# Altium schematic sheet GPIOSheet.SchDoc
size A; SheetNumber: 4; SheetTotal: 4
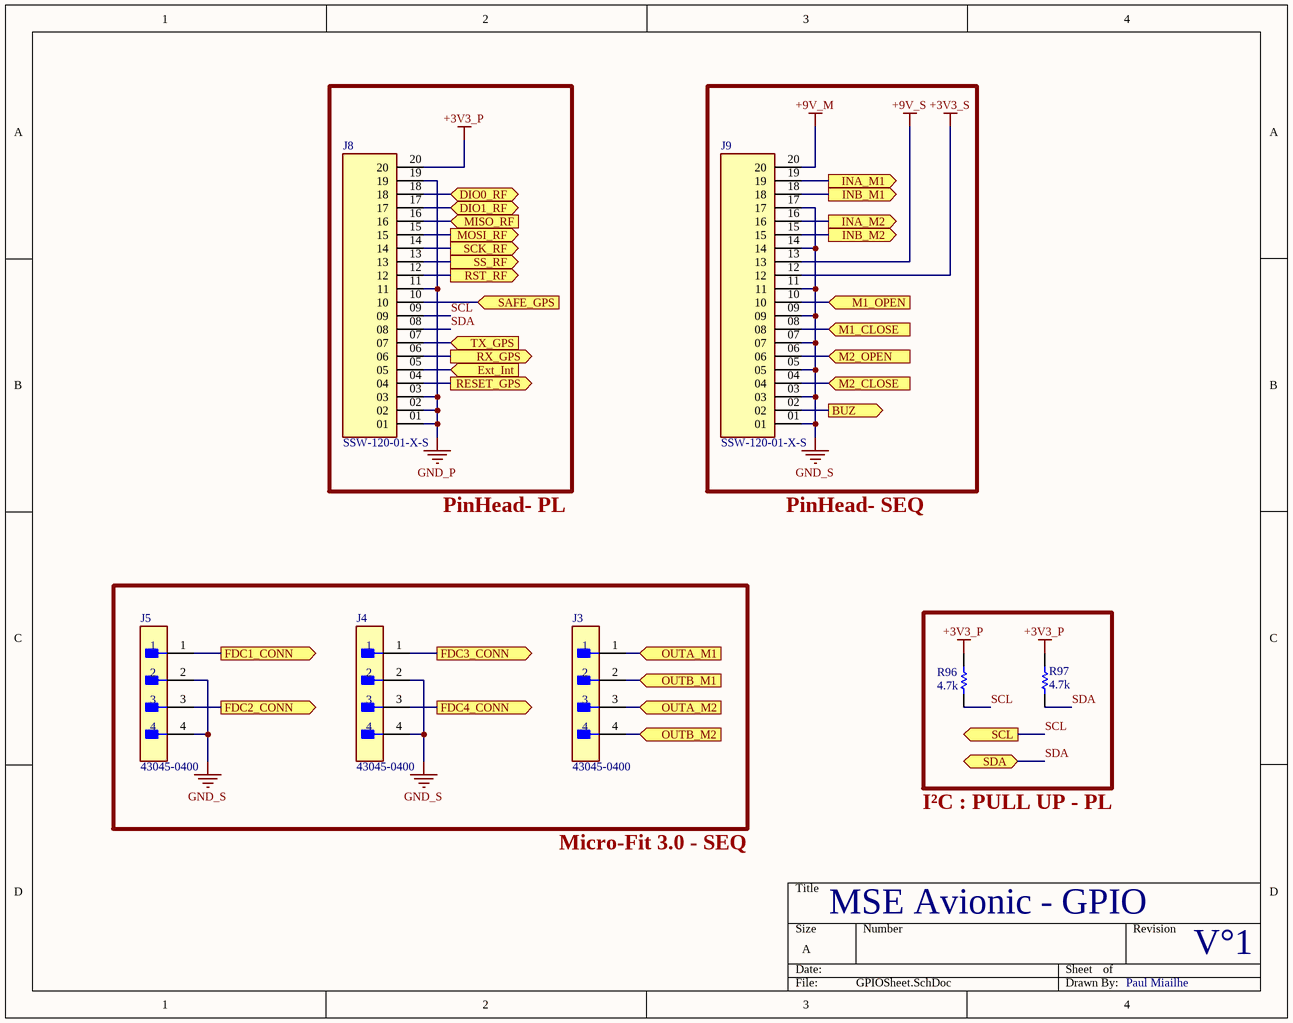
[diagram p0: GPIOSheet.SchDoc]

## Parts
J3  43045-0400  [FP-43045-0400-MFG]
J4  43045-0400  [FP-43045-0400-MFG]
J5  43045-0400  [FP-43045-0400-MFG]
J8  SSW-120-01-X-S  [SAMTEC_SSW-120-01-X-S]
J9  SSW-120-01-X-S  [SAMTEC_SSW-120-01-X-S]
R96  Resistance: 4.7k  [RESC1608X55X25LL10T15]  (hidden comment: RC0603FR-074K7L)
R97  Resistance: 4.7k  [RESC1608X55X25LL10T15]  (hidden comment: RC0603FR-074K7L)

## Ports
BUZ (out), DIO0_RF (bidir), DIO1_RF (bidir), Ext_Int (in), FDC1_CONN (out), FDC2_CONN (out), FDC3_CONN (out), FDC4_CONN (out), INA_M1 (out), INA_M2 (out), INB_M1 (out), INB_M2 (out), M1_CLOSE (in), M1_OPEN (in), M2_CLOSE (in), M2_OPEN (in), MISO_RF (in), MOSI_RF (out), OUTA_M1 (in), OUTA_M2 (in), OUTB_M1 (in), OUTB_M2 (in), RESET_GPS (out), RST_RF (out), RX_GPS (out), SAFE_GPS (in), SCK_RF (out), SCL (out), SDA (bidir), SS_RF (out), TX_GPS (in)

## Nets
+3V3_P: J8.20 R96.2 R97.2
+3V3_S: J9.12
+9V_M: J9.20
+9V_S: J9.13
GND_P: J8.01 J8.02 J8.03 J8.11 J8.19
GND_S: J4.2 J4.4 J5.2 J5.4 J9.01 J9.03 J9.05 J9.07 J9.09 J9.11 J9.14 J9.17
BUZ: J9.02 ; port BUZ
DIO0_RF: J8.18 ; port DIO0_RF
DIO1_RF: J8.17 ; port DIO1_RF
Ext_Int: J8.05 ; port Ext_Int
FDC1_CONN: J5.1 ; port FDC1_CONN
FDC2_CONN: J5.3 ; port FDC2_CONN
FDC3_CONN: J4.1 ; port FDC3_CONN
FDC4_CONN: J4.3 ; port FDC4_CONN
INA_M1: J9.19 ; port INA_M1
INA_M2: J9.16 ; port INA_M2
INB_M1: J9.18 ; port INB_M1
INB_M2: J9.15 ; port INB_M2
M1_CLOSE: J9.08 ; port M1_CLOSE
M1_OPEN: J9.10 ; port M1_OPEN
M2_CLOSE: J9.04 ; port M2_CLOSE
M2_OPEN: J9.06 ; port M2_OPEN
MISO_RF: J8.16 ; port MISO_RF
MOSI_RF: J8.15 ; port MOSI_RF
OUTA_M1: J3.1 ; port OUTA_M1
OUTA_M2: J3.3 ; port OUTA_M2
OUTB_M1: J3.2 ; port OUTB_M1
OUTB_M2: J3.4 ; port OUTB_M2
RESET_GPS: J8.04 ; port RESET_GPS
RST_RF: J8.12 ; port RST_RF
RX_GPS: J8.06 ; port RX_GPS
SAFE_GPS: J8.10 ; port SAFE_GPS
SCK_RF: J8.14 ; port SCK_RF
SCL: J8.09 R96.1 ; port SCL
SDA: J8.08 R97.1 ; port SDA
SS_RF: J8.13 ; port SS_RF
TX_GPS: J8.07 ; port TX_GPS

## Notes on the sheet
- PinHead- PL
- PinHead- SEQ
- Micro-Fit 3.0 - SEQ
- I²C : PULL UP - PL
- MSE Avionic - GPIO
- V°1
- Paul Miailhe

## Library data of the parts
J3-J5 = CMP-04776-000002-1: CONN HEADER R/A 4POS 3MM; Manufacturer: Molex; Conn Gender: Male; Conn Orientation: Right Angle; Voltage Rating: 600V; Number Of Contacts: 4; Is Female: yes; Current Rating: 8.5A; ComponentLink2URL: https://www.molex.com/webdocs/datasheets/pdf/en-us/0430450400_PCB_HEADERS.pdf; Manufacturer Part Number: 43045-0400; Digikey Description: CONN HEADER R/A 4POS 3MM; Category: Conn; Temperature Range High: +105°C; Lead Free: Yes; Device Class L1: Connectors; Automotive: No; Temperature: -40°C to +105°C; Footprint Url: https://www.molex.com/pdm_docs/sd/430450400_sd.pdf; Height: 9.27mm; Number Of Rows: 2; Device Class L3: unset; Pitch: 3mm; Temperature Range Low: -40°C; Contact Material: Tin,Nickel; Octopart: https://octopart.com/43045-0400-molex-287063; RoHS: TRUE; ComponentLink2Description: Datasheet; Package: 43045-0400; Device Class L2: Headers and Wire Housings
J8 J9 = CMP-011-000000-2: SSW - Samtec 2.54mm Single Row Straight Socket Strip 8.5 Profile - Fast Stock; MP: SSW-120-01-G-S; Value: *; Check_prices: https://www.snapeda.com/parts/SSW-120-01-G-S/Samtec/view-part/598388/?ref=eda; Price: None; Design Item ID: SSW-120-01-X-S; SnapEDA_Link: https://www.snapeda.com/parts/SSW-120-01-G-S/Samtec/view-part/598388/?ref=snap; Component Type: Standard; MF: Samtec; Source: SSW-120-01-X-S.SchLib; Package: None; Pin Count: 20; Availability: Bad; Purchase-URL: https://pricing.snapeda.com/search/part/SSW-120-01-G-S/?ref=eda
R96 R97 = CMP-2000-06942-1: Chip Resistor, 4.7 KOhm, +/- 1%, 0.1 W, -55 to 155 degC, 0603 (1608 Metric), RoHS, Tape and Reel; Manufacturer: Yageo; Power Rating: 100mW; Temperature Coefficient: 100PPM/C; Voltage Rating: 50V; Package Reference: 0603; Series: RC; Datasheet Version: Rev. 7, 05/2017; Packaging: Reel; Termination Style: SMD/SMT; Datasheet URL: http://www.yageo.com/documents/recent/PYu-RC_Group_51_RoHS_L_7.pdf; Manufacturer URL: http://www.yageo.com/; Package Description: 2-Pin Surface Mount Device, Body 1.6 x 0.8 mm; Case Code - mm: 1608; Mounting Technology: SurfaceMount; Operating Temperature Range: -55Cto+155C; Tolerance: 1%; Product: ThickFilmResistorsGeneralPurpose; Supplier 1: Mouser; Supplier Part Number 1: 603-RC0603FR-074K7L; Manufacturer Part Number: RC0603FR-074K7L; RoHS: Yes; Category: Chip SMD Resistors; Stock 1: 772810; Pricing 1: 1=0,10000, 10=0,02400, 50=0,02400, 100=0,01000, 1000=0,00400, 5000=0,00300, 10000=0,00300 (USD); Case/Package: 0603; Number of Pins: 2; Case Code (Imperial): 0603; Case Code (Metric): 1608; Size Code: 0603; Min Operating Temperature: -55°C; Max Operating Temperature: 155°C; Voltage Rating (DC): 50V; Termination: SMD/SMT; Resistor Type: Thick Film; Features: Moisture Resistant; Max Power Dissipation: 100mW; Number of Terminations: 2; Construction: Rectangular; Resistance Tolerance: 1%; Length: 1.6mm; Width: 0.8mm; Height: 0.45mm; Depth: 0.8mm; Lead Pitch: 0.3mm; REACH SVHC: No SVHC; Military Standard: Not; Lead Free: Lead Free; RoHS Compliant: Yes; ComponentLink1URL: https://datasheet.ciiva.com/15189/getdatasheetpartid-422754-15189760.pdf?src-supplier=Verical; ComponentLink1Description: https://datasheet.ciiva.com/15189/getdatasheetpartid-422754-15189760.pdf?src-supplier=Verical; ComponentLink2URL: https://datasheet.ciiva.com/22747/443971-22747528.pdf?src-supplier=Element14; ComponentLink2Description: https://datasheet.ciiva.com/22747/443971-22747528.pdf?src-supplier=Element14; ComponentLink3URL: https://datasheet.ciiva.com/7660/38590-7660794.pdf?src-supplier=Element14; ComponentLink3Description: https://datasheet.ciiva.com/7660/38590-7660794.pdf?src-supplier=Element14; ComponentLink4URL: https://datasheet.ciiva.com/7746/1868787-7746365.pdf?src-supplier=Element14; ComponentLink4Description: https://datasheet.ciiva.com/7746/1868787-7746365.pdf?src-supplier=Element14; ComponentLink5URL: https://datasheet.ciiva.com/46440/1868787-46440909.pdf?src-supplier=Element14; ComponentLink5Description: https://datasheet.ciiva.com/46440/1868787-46440909.pdf?src-supplier=Element14; ComponentLink6URL: https://datasheet.ciiva.com/7746/1738695-7746366.pdf?src-supplier=Element14; ComponentLink6Description: https://datasheet.ciiva.com/7746/1738695-7746366.pdf?src-supplier=Element14